# EAGLE design usbasp (EAGLE 6.4)
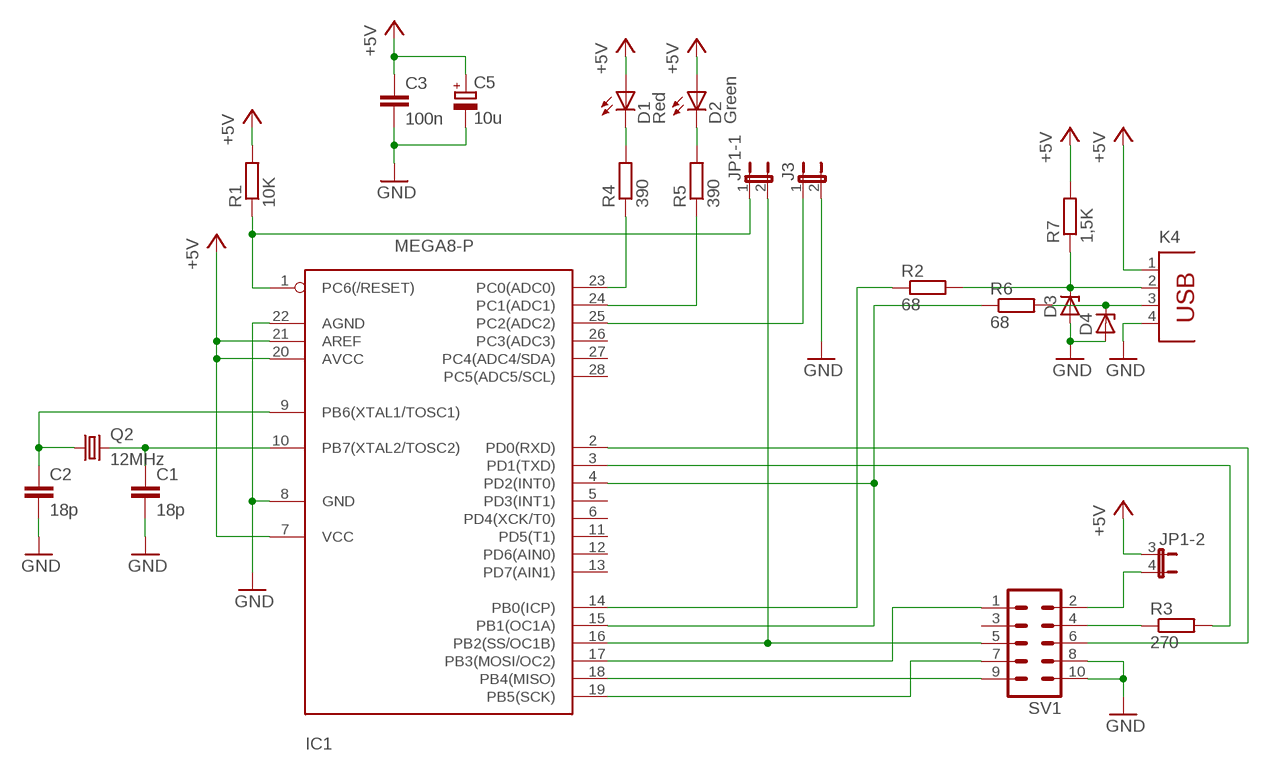
[diagram p0: schematic, sheet 1]

## Parts
C1  18p  C-EU025-024X044  [C025-024X044]
C2  18p  C-EU025-024X044  [C025-024X044]
C3  100n  C7.5/3  [C7.5B3]
C5  10u  CPOL-EUE2.5-5  [E2,5-5]
D1  Red  LED5MM  [LED5MM]
D2  Green  LED5MM  [LED5MM]
D3  ZENER-DIODEZD-5  [ZDIO-5]
D4  ZENER-DIODEZD-2.5  [ZDIO-2.5]
IC1  MEGA8-P  [DIL28-3]
J3  JP1E  [JP1]
JP1  JP2QE  [JP2Q]
K4  PN87520  [PN87520]
Q2  12MHz  CRYTALHC49S  [HC49/S]
R1  10K  R-EU_0207/10  [0207/10]
R2  68  R-EU_0207/10  [0207/10]
R3  270  R-EU_0207/10  [0207/10]
R4  390  R-EU_0207/10  [0207/10]
R5  390  R-EU_0207/10  [0207/10]
R6  68  R-EU_0207/10  [0207/10]
R7  1,5K  R-EU_0207/10  [0207/10]
SV1  ML10  [ML10]

## Nets
+5V: C3.1 C5.+ D1.A D2.A IC1.7(VCC) IC1.20(AVCC) IC1.21(AREF) JP1.3 K4.1 R1.2 R7.2
GND: C1.2 C2.2 C3.2 C5.- D3.A D4.A IC1.8(GND) IC1.22(AGND) J3.2 K4.4 SV1.8 SV1.10
N$1: D3.C K4.2 R2.2 R7.1
N$2: D4.C K4.3 R6.2
N$3: C1.1 IC1.10(PB7(XTAL2/TOSC2)) Q2.2
N$4: C2.1 IC1.9(PB6(XTAL1/TOSC1)) Q2.1
N$5: JP1.4 SV1.2
N$6: R3.1 SV1.4
N$7: IC1.3(PD1(TXD)) R3.2
N$8: IC1.2(PD0(RXD)) SV1.6
N$9: IC1.17(PB3(MOSI/OC2)) SV1.1
N$10: IC1.19(PB5(SCK)) SV1.7
N$11: IC1.18(PB4(MISO)) SV1.9
N$12: IC1.16(PB2(SS/OC1B)) JP1.2 SV1.5
N$13: IC1.1(PC6(/RESET)) JP1.1 R1.1
N$14: IC1.14(PB0(ICP)) R2.1
N$15: IC1.25(PC2(ADC2)) J3.1
N$16: IC1.23(PC0(ADC0)) R4.1
N$17: IC1.24(PC1(ADC1)) R5.1
N$18: IC1.4(PD2(INT0)) IC1.15(PB1(OC1A)) R6.1
N$19: D1.K(C) R4.2
N$20: D2.K(C) R5.2
Unconnected: IC1.5(PD3(INT1)) IC1.6(PD4(XCK/T0)) IC1.11(PD5(T1)) IC1.12(PD6(AIN0)) IC1.13(PD7(AIN1)) IC1.26(PC3(ADC3)) IC1.27(PC4(ADC4/SDA)) IC1.28(PC5(ADC5/SCL)) SV1.3

## Library data of the parts
C1 C2 = rcl:C-EU: CAPACITOR, European symbol
C3 = capacitor-wima:C: CAPACITOR naming: grid - package width
C5 = rcl:CPOL-EU: POLARIZED CAPACITOR, European symbol
D1 D2 = led:LED: LED OSRAM: - CHIPLED LG R971, LG N971, LY N971, LG Q971, LY Q971, LO R971, LY R971 LH N974, LH R974 LS Q976, LO Q976, LY Q976 LO Q996 - Hyper CHIPLED LW Q18S LB Q993, LB Q99A, LB R99A - SideLED LS A670, LO A670, LY A670, LG A670, LP A670 LB A673, LV A673, LT A673, LW A673 LH A674 LY A675 LS A676, LA A676, LO A676, LY A676, LW A676 LS A679, LY A679, LG A679 - Hyper Micro SIDELED® LS Y876, LA Y876, LO Y876, LY Y876 LT Y87S - SmartLED LW L88C, LW L88S LB L89C, LB L89S, LG L890 LS L89K, LO L89K, LY L89K LS L896, LA L896, LO L896, LY L896 - TOPLED LS T670, LO T670, LY T670, LG T670, LP T670 LSG T670, LSP T670, LSY T670, LOP T670, LYG T670 LG T671, LOG T671, LSG T671 LB T673, LV T673, LT T673, LW T673 LH T674 LS T676, LA T676, LO T676, LY T676, LB T676, LH T676, LSB T676, LW T676 LB T67C, LV T67C, LT T67C, LS T67K, LO T67K, LY T67K, LW E67C LS E67B, LA E67B, LO E67B, LY E67B, LB E67C, LV E67C, LT E67C LW T67C LS T679, LY T679, LG T679 LS T770, LO T770, LY T770, LG T770, LP T770 LB T773, LV T773, LT T773, LW T773 LH T774 LS E675, LA E675, LY E675, LS T675 LS T776, LA T776, LO T776, LY T776, LB T776 LHGB T686 LT T68C, LB T68C - Hyper Mini TOPLED® LB M676 - Mini TOPLED Santana® LG M470 LS M47K, LO M47K, LY M47K Source: http://www.osram.convergy.de/
D3 D4 = diode:ZENER-DIODE: Z-Diode
IC1 = atmel:MEGA8-P: MICROCONTROLLER 8 Kbytes FLASH 1 kbytes SRAM 512 bytes EEPROM USART 4-channel 10 bit ADC 2-channel 8 bit ADC Source: avr.lbr
J3 = jumper:JP1E: JUMPER
JP1 = jumper:JP2QE: JUMPER
K4 = con-berg:PN87520: BERG USB connector; OC_FARNELL: unknown; OC_NEWARK: unknown
Q2 = crystal:CRYTAL: CRYSTAL
R1-R7 = rcl:R-EU_: RESISTOR, European symbol
SV1 = con-harting-ml:ML10: HARTING

## Board
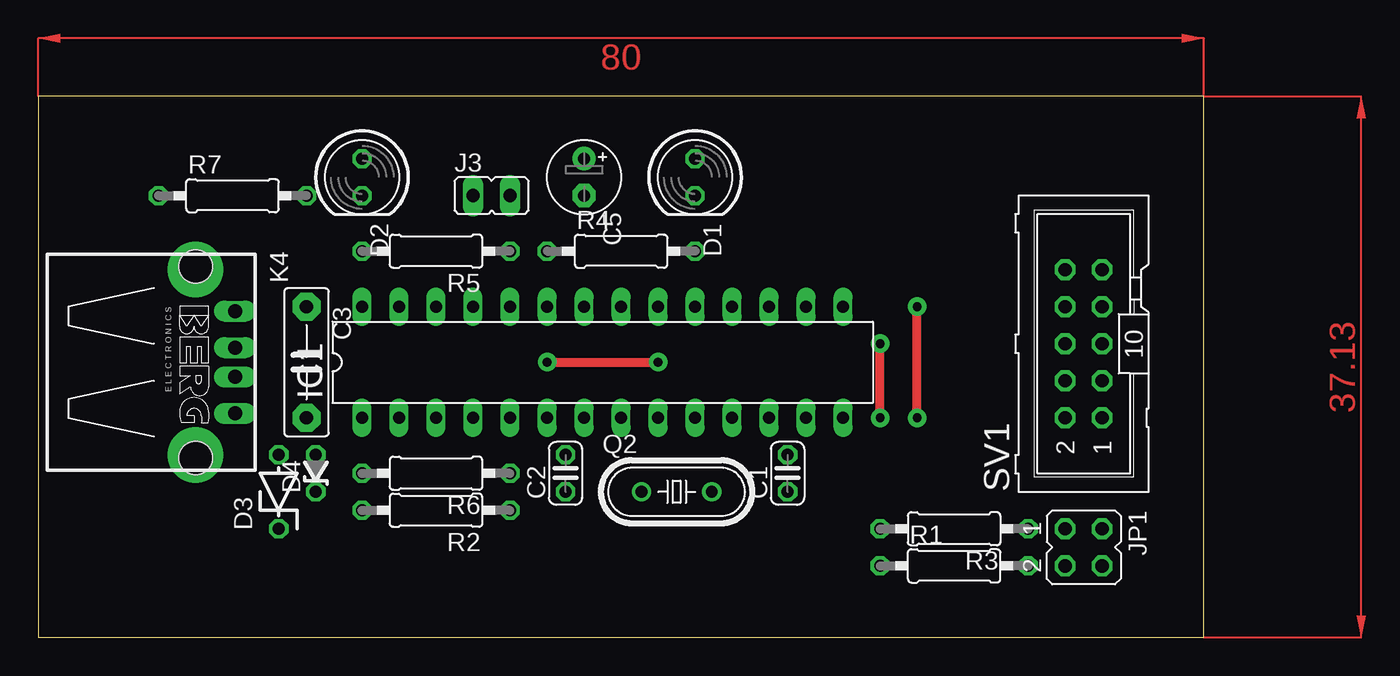
[diagram p1: board, top side]
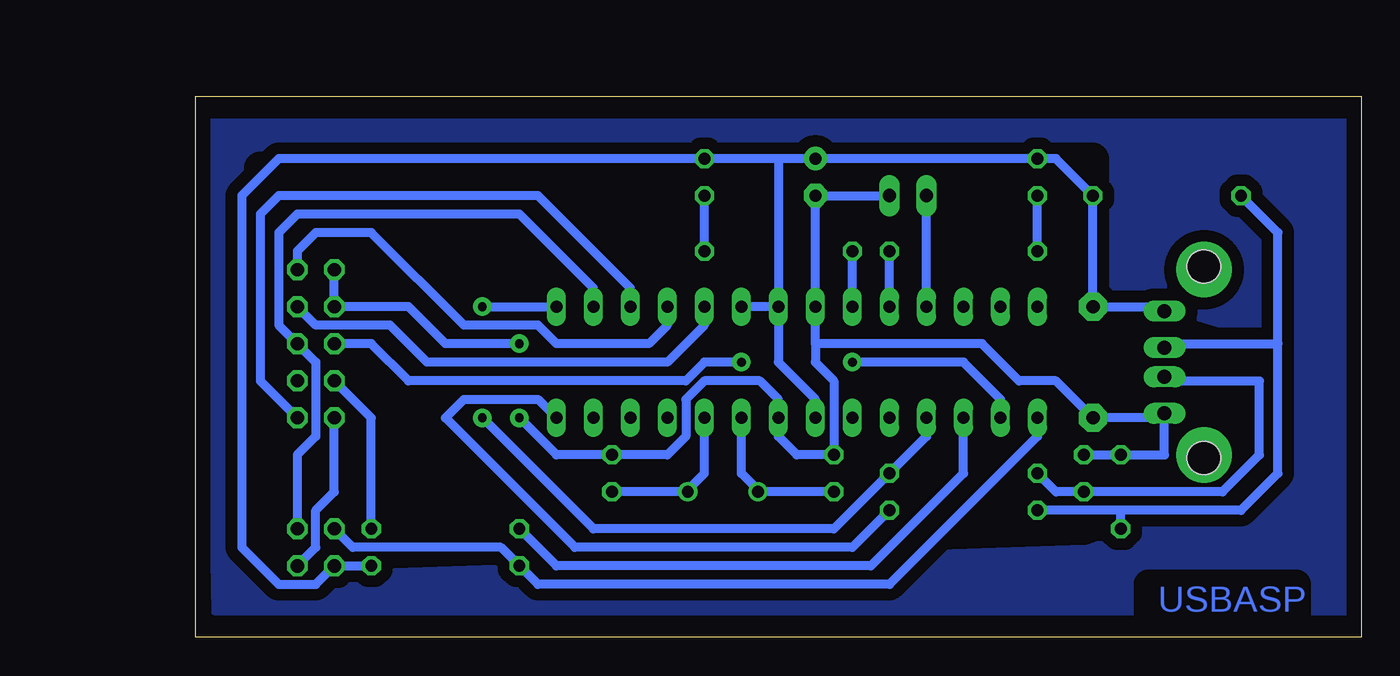
[diagram p2: board, bottom side, seen from below]

Size 80 x 37.13 mm. Coordinates in mm from the lower left corner, seen from the top.
Outline: 80,0 80,37.13 0,37.13 0,0 80,0
Copper layers (1*16): Top 0.035mm / dielectric 1.5mm / Bottom 0.035mm
Design rules "default": minimum track width 10mil, minimum drill 24mil, track to track 8mil, track to pad 8mil, pad to pad 8mil, via to via 8mil, smd to smd 8mil, copper to edge 40mil, drill to drill 8mil, minimum pad ring 10mil, minimum via ring 8mil, stop-mask expansion 4mil, vias tented up to drill 0mil, thermal gap 10mil
bRestrict: area 5.7,5.5 to 75.6,32.9; 4 lines

### Footprints (pad centres in the part's own frame; a part is rotated, then mirrored left to right if it is on the bottom)
C025-024X044 = drill 0.813 octagon: 1 -1.27,0; 2 1.27,0
C7.5B3 = drill 0.914 pad 1.905 octagon: 1 -3.81,0; 2 3.81,0
E2,5-5 = drill 0.813 pad 1.6: + -1.27,0 | drill 0.813 pad 1.6 octagon: - 1.27,0
LED5MM = drill 0.813 octagon: A -1.27,0; K 1.27,0
ZDIO-5 = drill 0.813 octagon: A 2.54,0; C -2.54,0
ZDIO-2.5 = drill 0.813 octagon: A 1.27,0; C -1.27,0
DIL28-3 = drill 0.813 long: 1 -16.51,-3.81; 2 -13.97,-3.81; 3 -11.43,-3.81; 4 -8.89,-3.81; 5 -6.35,-3.81; 6 -3.81,-3.81; 7 -1.27,-3.81; 8 1.27,-3.81; 9 3.81,-3.81; 10 6.35,-3.81; 11 8.89,-3.81; 12 11.43,-3.81; 13 13.97,-3.81; 14 16.51,-3.81; 15 16.51,3.81; 16 13.97,3.81; 17 11.43,3.81; 18 8.89,3.81; 19 6.35,3.81; 20 3.81,3.81; 21 1.27,3.81; 22 -1.27,3.81; 23 -3.81,3.81; 24 -6.35,3.81; 25 -8.89,3.81; 26 -11.43,3.81; 27 -13.97,3.81; 28 -16.51,3.81
JP1 = drill 0.914 long: 1 0,-1.27; 2 0,1.27
JP2Q = drill 0.914 octagon: 1 -1.27,-1.27; 2 -1.27,1.27; 3 1.27,-1.27; 4 1.27,1.27
PN87520 = drill 0.95 long: 1 -3.5,2.71; 2 -1,2.71; 3 1,2.71; 4 3.5,2.71 | hole 2.3: -6.57,0; 6.57,0
HC49/S = drill 0.813: 1 -2.413,0; 2 2.413,0
0207/10 = drill 0.813 octagon: 1 -5.08,0; 2 5.08,0
ML10 = drill 0.914 octagon: 1 -5.08,-1.27; 2 -5.08,1.27; 3 -2.54,-1.27; 4 -2.54,1.27; 5 0,-1.27; 6 0,1.27; 7 2.54,-1.27; 8 2.54,1.27; 9 5.08,-1.27; 10 5.08,1.27

### Placement (x,y rotation side)
C1  51.43,11.26 90 top
C2  36.19,11.26 90 top
C3  18.41,18.88 270 top
C5  37.46,31.59 270 top
D1  45.08,31.59 270 top
D2  22.22,31.59 270 top
D3  16.5,9.99 90 top
D4  19.04,11.26 90 top
IC1  38.73,18.88 0 top
J3  31.11,30.31 270 top
JP1  71.75,6.19 270 top
K4  10.79,18.88 270 top
Q2  43.81,9.99 0 top
R1  62.86,4.92 0 top
R2  27.3,8.72 180 top
R3  62.86,7.46 180 top
R4  40,26.5 0 top
R5  27.3,26.5 180 top
R6  27.3,11.26 180 top
R7  13.33,30.31 0 top
SV1  71.75,20.16 90 top

### Tracks (layer width: path | path; a pad name or v marks a point on that pad's centre or on a via)
+5V
  Bottom 0.61: IC1.7 37.46,16.34 40,18.88 IC1.21 | 40,32.85 C5.+ D2.A 20.95,32.85 R7.2 C3.1 13.5,22.7 K4.1 | R1.2 JP1.3 71.75,3.65 74.29,3.65 76.83,6.19 76.83,30.31 74.29,32.85 D1.A 40,32.85 | IC1.21 IC1.20 | 40,32.85 IC1.21
GND  (via drill 0.6 pad 1.27)
  Top 0.61: v57.78,15.08 v57.78,20.16
  Bottom 0.61: v57.78,15.08 55.24,12.53 C1.2 47.62,12.53 46.35,13.81 46.35,16.34 45.08,17.62 41.27,17.62 40,16.34 IC1.8 40,13.81 38.73,12.53 C2.2 36.19,17.62 37.46,18.88 37.46,20.16 | v57.78,20.16 62.86,20.16 65.4,22.7 SV1.8 SV1.10 | 37.46,20.16 IC1.22 C5.- J3.2 | 37.46,20.16 26.03,20.16 23.49,17.62 20.95,17.62 C3.2 13.81,15.08 K4.4 13.5,12.53 D3.A D4.A
  pour Bottom (isolate 0.813, no thermals): 0.63,35.39 79.37,35.39 78.73,1.74 -0.01,1.74
N$1
  Bottom 0.61: 5.71,20.16 5.71,11.26 8.25,8.72 16.5,8.72 | 5.71,20.16 5.71,27.77 R7.1 | K4.2 13.23,20.16 5.71,20.16 | 16.5,8.72 R2.2 | D3.C 16.5,8.72
N$2
  Bottom 0.61: R6.2 20.95,9.99 D4.C 9.52,9.99 6.98,12.53 6.98,17.62 13.23,17.62 K4.3
N$3
  Bottom 0.61: IC1.10 45.08,11.26 46.35,9.99 Q2.2 C1.1
N$4
  Bottom 0.61: IC1.9 42.54,11.26 41.27,9.99 | C2.1 41.27,9.99 | 41.27,9.99 Q2.1
N$5
  Bottom 0.61: JP1.4 71.75,6.19 71.75,8.72 70.48,9.99 SV1.2
N$6
  Bottom 0.61: R3.1 67.94,15.08 SV1.4
N$7
  Bottom 0.61: IC1.3 27.3,11.26 33.65,4.92 55.24,4.92 R3.2
N$8  (via drill 0.6 pad 1.27)
  Top 0.61: v34.92,18.88 v42.54,18.88
  Bottom 0.61: v42.54,18.88 45.08,18.88 46.35,17.62 65.4,17.62 67.94,20.16 SV1.6 | IC1.2 24.76,16.34 27.3,18.88 v34.92,18.88
N$9
  Bottom 0.61: IC1.17 50.16,23.96 56.51,30.31 74.29,30.31 75.56,29.04 75.56,17.62 SV1.1
N$10
  Bottom 0.61: IC1.19 45.08,21.42 47.62,18.88 64.13,18.88 66.67,21.42 71.75,21.42 SV1.7
N$11
  Bottom 0.61: SV1.9 73.02,26.5 71.75,27.77 67.94,27.77 61.59,21.42 56.51,21.42 55.24,20.16 48.89,20.16 47.62,21.42 IC1.18
N$12
  Bottom 0.61: IC1.16 52.7,23.96 57.78,29.04 73.02,29.04 74.29,27.77 74.29,21.42 SV1.5 71.75,18.88 71.75,13.81 73.02,12.53 JP1.2
N$13
  Bottom 0.61: IC1.1 22.22,13.81 32.38,3.65 56.51,3.65 R1.1 59.05,6.19 69.21,6.19 JP1.1
N$14
  Bottom 0.61: IC1.14 56.51,16.34 61.59,16.34 62.86,15.08 53.97,6.19 34.92,6.19 R2.1
N$15
  Bottom 0.61: IC1.25 J3.1
N$16
  Bottom 0.61: IC1.23 R4.1
N$17
  Bottom 0.61: IC1.24 R5.1
N$18  (via drill 0.6 pad 1.27)
  Top 0.61: v60.32,15.08 v60.32,22.7
  Bottom 0.61: v60.32,15.08 52.7,7.46 36.19,7.46 R6.1 29.84,13.81 IC1.4 | v60.32,22.7 IC1.15
N$19
  Bottom 0.61: R4.2 D1.K
N$20
  Bottom 0.61: R5.2 D2.K
N$21  (via drill 1.5 pad 3.81)
  other vias: 10.79,25.23
N$22  (via drill 1.5 pad 3.81)
  other vias: 10.79,12.53
(copper drawn outside any net)
  shapes: Top area x2

### Text on the board
Bottom: USBASP